# Altium schematic sheet GPIO.SchDoc: APTOMAT - Power Supply
size A4; Revision: 1.1.1; SheetNumber: 5; SheetTotal: 5; DrawnBy: KJP; ProjectNumber: 4397; PCBRevision: 0071KJP; DocumentSize: A4; PCAName: PCA10040; PCBNumber: 400150; ProjectName: Quark
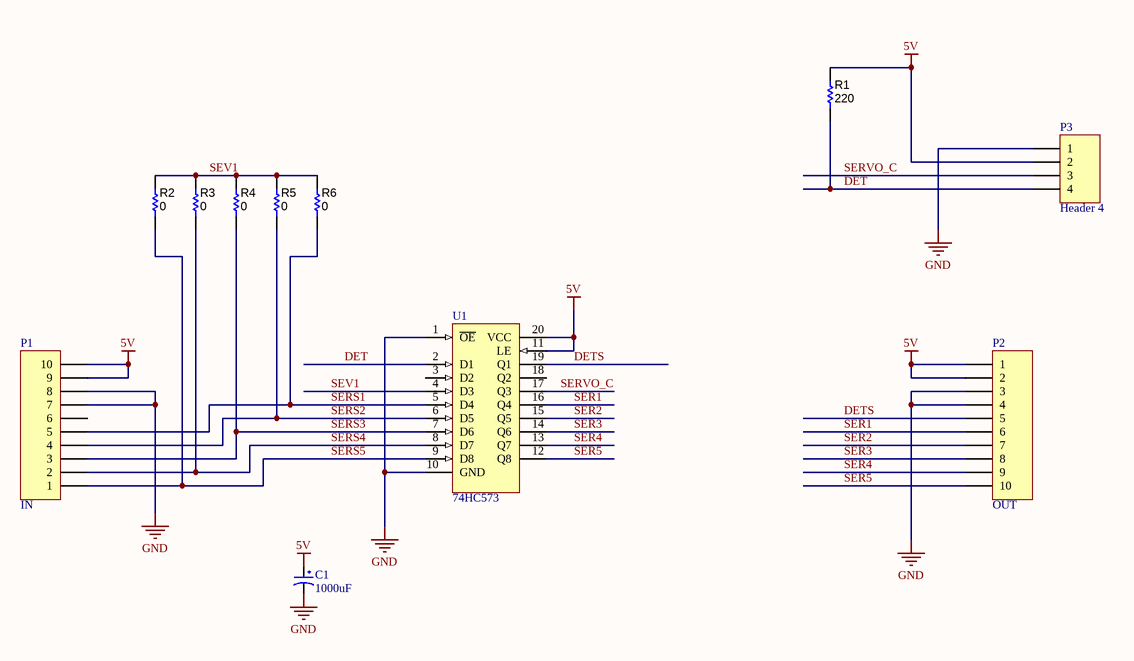
[diagram p0: GPIO.SchDoc]

## Parts
C1  1000uF  [TU_NHOM_470uF_25V_MH]
P1  IN  [JST-PH2.00-10P]
P2  OUT  [JST-PH2.00-10P]
P3  Header 4  [SpringCON]
R1  220  [Tro SMD 0805]
R2  0  [Tro SMD 0805]
R3  0  [Tro SMD 0805]
R4  0  [Tro SMD 0805]
R5  0  [Tro SMD 0805]
R6  0  [Tro SMD 0805]
U1  74HC573  [SOIC-20]

## Nets
5V: C1.1 P1.9 P1.10 P2.1 P2.2 P3.2 R1.1 U1.11(LE) U1.20(VCC)
GND: C1.2 P1.7 P1.8 P2.3 P2.4 P3.1 U1.1(~{OE}) U1.10(GND)
DET: P3.4 R1.2 U1.2(D1)
DETS: P2.5 U1.19(Q1)
SER1: P2.6 U1.16(Q4)
SER2: P2.7 U1.15(Q5)
SER3: P2.8 U1.14(Q6)
SER4: P2.9 U1.13(Q7)
SER5: P2.10 U1.12(Q8)
SERS1: P1.5 R6.2 U1.5(D4)
SERS2: P1.4 R5.2 U1.6(D5)
SERS3: P1.3 R4.2 U1.7(D6)
SERS4: P1.2 R3.2 U1.8(D7)
SERS5: P1.1 R2.2 U1.9(D8)
SERVO_C: P3.3 U1.17(Q3)
SEV1: R2.1 R3.1 R4.1 R5.1 R6.1 U1.4(D3)

Not connected (* = marked no-connect by the designer): P1 6; U1 3(D2) 18(Q2)

## Library data of the parts
C1 = TU_NHOM_1000uF_16V_MH: Value: 47uF/16 - 50V; Description 1: 470uF/6,3V - 330uF/10V - 220uF/16V; Description 2: 100uF/25V - 35V - 47uF/50V - 22uF/100V; Description 3: 33uF => 47uF/63V - 1uF => 4,7uF/160V; Description 4: 1uF => 2,2uF/250V - 1uF/350V
P1 P2 = Header 10: Header, 10-Pin; LatestRevisionDate: 17-Jul-2002; LatestRevisionNote: Re-released for DXP Platform.; Publisher: Altium Limited
P3 = Header 4: Header, 4-Pin; LatestRevisionDate: 17-Jul-2002; LatestRevisionNote: Re-released for DXP Platform.; Publisher: Altium Limited
R1-R6 = R nho: RES, 100, 1%, 0.1 W, 0402; PartNumber: ERJ-2RKF1000X; Manufacturer: Panasonic; CompType: Resistor; Res_ohm: 100; Value_Code: 100R; Tolerance_%: 1; Power_W: 0.1; Value2: 0.1W; VDC_V: 50; TempCo: 100 ppm/C; EIA_Code: E96; U/M: EA; AEC Category: Q200; SymbolVersion: 2009-05-29; PackageReference: 0402; RoHS: Y; Value1: 1%; MountType: SMT; Technology: Thick Film; Published: 2008-06-26; Publisher: Texas Instruments; LatestRevisionDate: 2016-01-08; ComponentLink1Description: Datasheet link; ComponentLink1URL: http://industrial.panasonic.com/www-data/pdf/AOA0000/AOA0000CE2.pdf; Supplier 1: Digi-Key; Supplier Part Number 1: P100LCT-ND; Supplier 2: Mouser; Supplier Part Number 2: 667-ERJ-2RKF1000X; Supplier 3: Farnell; Supplier Part Number 3: 2304034; AEC Qualified: ?
  R1: Value: 220
  R2-R6: Value: 0
U1 = 74HC573 DIP20 IC Flip-Flop_MH: Octal D-Type Latch with 3-State Output Non-Inverting; Value: 74HC573; Copyright by: VanDungEvn@Gmail.com